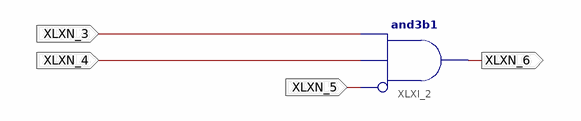
[diagram p0: schematic sheet 1]
// Xilinx ISE schematic sch1.sch (xbr) as structural Verilog: 1 symbols, 4 ports
module sch1 (
  input  XLXN_3,
  input  XLXN_4,
  input  XLXN_5,
  output XLXN_6
);

  and XLXI_2 (XLXN_6, ~XLXN_5, XLXN_4, XLXN_3);  // and3b1
endmodule
